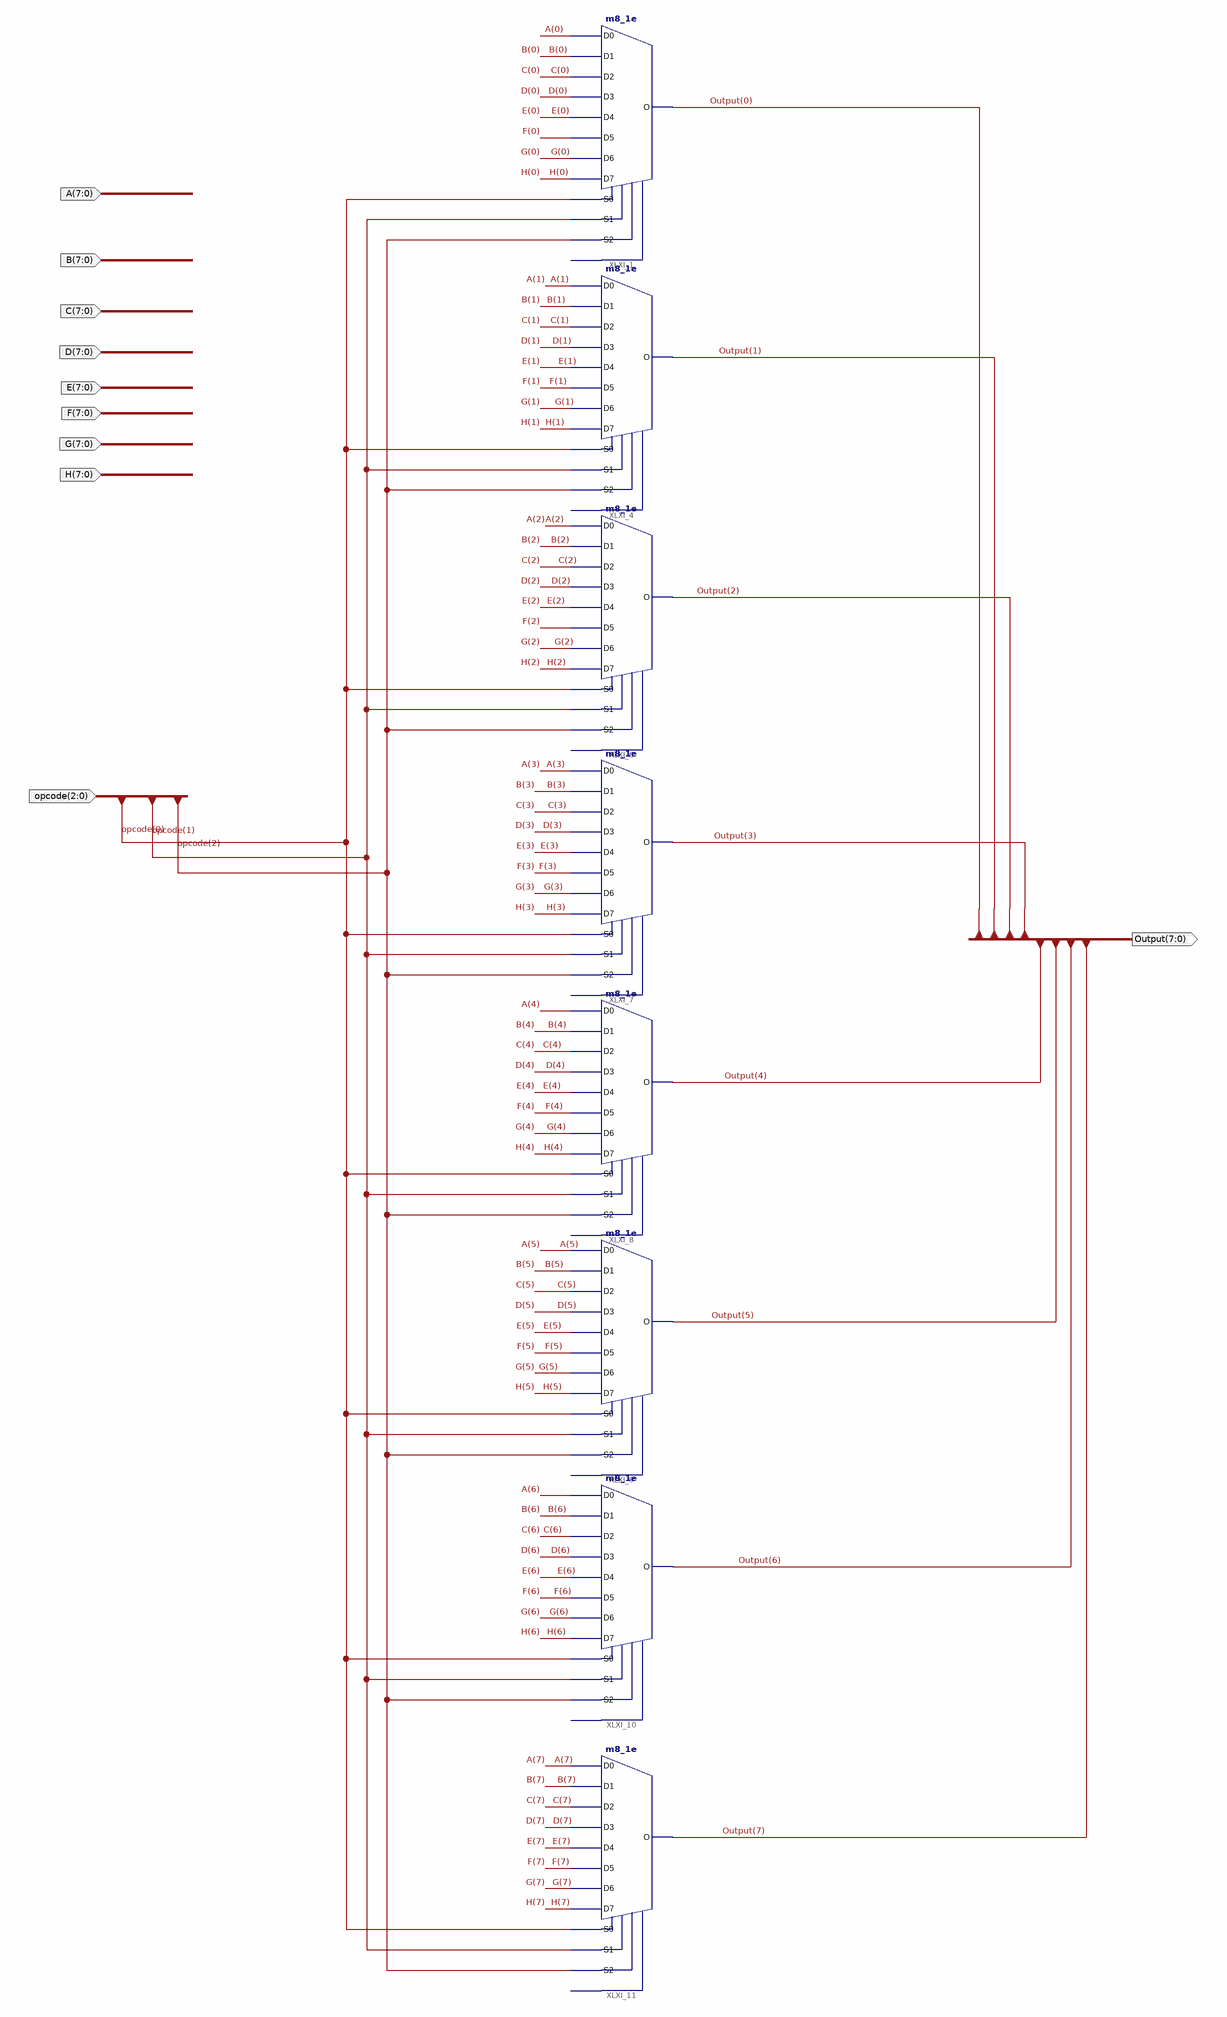
[diagram p0: schematic sheet 1]
// Xilinx ISE schematic proj1mux8to8.sch (spartan6) as structural Verilog: 8 symbols, 10 ports
module proj1mux8to8 (
  input  [7:0] A,
  input  [7:0] B,
  input  [2:0] opcode,
  input  [7:0] C,
  input  [7:0] D,
  input  [7:0] E,
  input  [7:0] F,
  input  [7:0] G,
  input  [7:0] H,
  output [7:0] Output
);

  m8_1e XLXI_1 (
    .D0(A[0]), .D1(B[0]), .D2(C[0]), .D3(D[0]), .D4(E[0]), .D5(F[0]), .D6(G[0]), .D7(H[0]), .S0(opcode[0]),
    .S1(opcode[1]), .S2(opcode[2]), .O(Output[0]));  // open: E
  m8_1e XLXI_4 (
    .D0(A[1]), .D1(B[1]), .D2(C[1]), .D3(D[1]), .D4(E[1]), .D5(F[1]), .D6(G[1]), .D7(H[1]), .S0(opcode[0]),
    .S1(opcode[1]), .S2(opcode[2]), .O(Output[1]));  // open: E
  m8_1e XLXI_6 (
    .D0(A[2]), .D1(B[2]), .D2(C[2]), .D3(D[2]), .D4(E[2]), .D5(F[2]), .D6(G[2]), .D7(H[2]), .S0(opcode[0]),
    .S1(opcode[1]), .S2(opcode[2]), .O(Output[2]));  // open: E
  m8_1e XLXI_7 (
    .D0(A[3]), .D1(B[3]), .D2(C[3]), .D3(D[3]), .D4(E[3]), .D5(F[3]), .D6(G[3]), .D7(H[3]), .S0(opcode[0]),
    .S1(opcode[1]), .S2(opcode[2]), .O(Output[3]));  // open: E
  m8_1e XLXI_8 (
    .D0(A[4]), .D1(B[4]), .D2(C[4]), .D3(D[4]), .D4(E[4]), .D5(F[4]), .D6(G[4]), .D7(H[4]), .S0(opcode[0]),
    .S1(opcode[1]), .S2(opcode[2]), .O(Output[4]));  // open: E
  m8_1e XLXI_9 (
    .D0(A[5]), .D1(B[5]), .D2(C[5]), .D3(D[5]), .D4(E[5]), .D5(F[5]), .D6(G[5]), .D7(H[5]), .S0(opcode[0]),
    .S1(opcode[1]), .S2(opcode[2]), .O(Output[5]));  // open: E
  m8_1e XLXI_10 (
    .D0(A[6]), .D1(B[6]), .D2(C[6]), .D3(D[6]), .D4(E[6]), .D5(F[6]), .D6(G[6]), .D7(H[6]), .S0(opcode[0]),
    .S1(opcode[1]), .S2(opcode[2]), .O(Output[6]));  // open: E
  m8_1e XLXI_11 (
    .D0(A[7]), .D1(B[7]), .D2(C[7]), .D3(D[7]), .D4(E[7]), .D5(F[7]), .D6(G[7]), .D7(H[7]), .S0(opcode[0]),
    .S1(opcode[1]), .S2(opcode[2]), .O(Output[7]));  // open: E
endmodule
